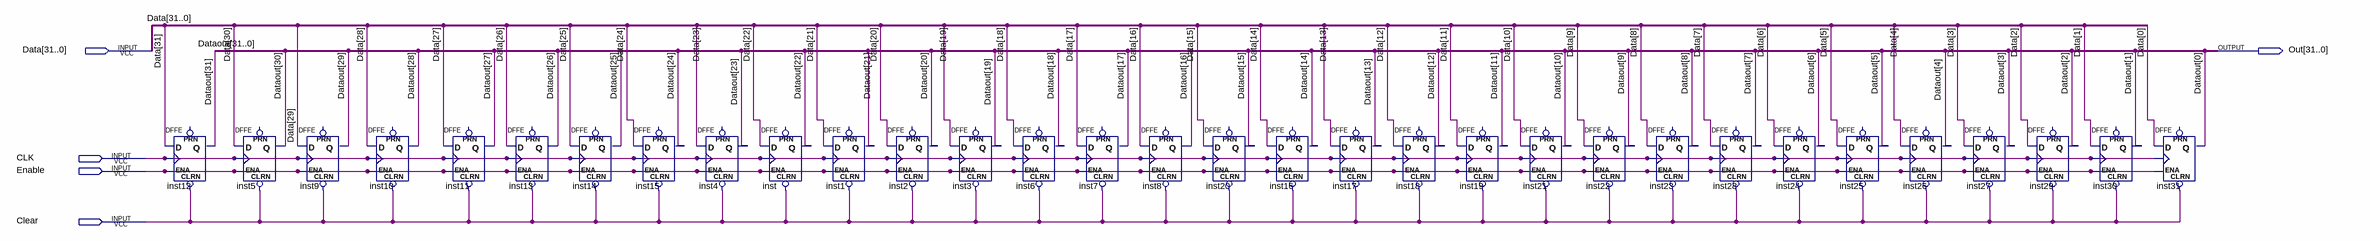
[diagram p0: schematic sheet]
// Quartus schematic Registrador32Bits.bdf as structural Verilog: 32 symbols, 5 pins
module Registrador32Bits (
  input  [31:0] Data,
  input  CLK,
  input  Enable,
  input  Clear,
  output [31:0] Out
);

  DFFE inst12 (.CLRN(Clear), .D(Data[31]), .CLK(CLK), .ENA(Enable), .Q(Out[31]));  // open: PRN
  DFFE inst5 (.CLRN(Clear), .D(Data[30]), .CLK(CLK), .ENA(Enable), .Q(Out[30]));  // open: PRN
  DFFE inst9 (.CLRN(Clear), .D(Data[29]), .CLK(CLK), .ENA(Enable), .Q(Out[29]));  // open: PRN
  DFFE inst10 (.CLRN(Clear), .D(Data[28]), .CLK(CLK), .ENA(Enable), .Q(Out[28]));  // open: PRN
  DFFE inst11 (.CLRN(Clear), .D(Data[27]), .CLK(CLK), .ENA(Enable), .Q(Out[27]));  // open: PRN
  DFFE inst13 (.CLRN(Clear), .D(Data[26]), .CLK(CLK), .ENA(Enable), .Q(Out[26]));  // open: PRN
  DFFE inst14 (.CLRN(Clear), .D(Data[25]), .CLK(CLK), .ENA(Enable), .Q(Out[25]));  // open: PRN
  DFFE inst15 (.CLRN(Clear), .D(Data[24]), .CLK(CLK), .ENA(Enable), .Q(Out[24]));  // open: PRN
  DFFE inst4 (.CLRN(Clear), .D(Data[23]), .CLK(CLK), .ENA(Enable), .Q(Out[23]));  // open: PRN
  DFFE inst (.CLRN(Clear), .D(Data[22]), .CLK(CLK), .ENA(Enable), .Q(Out[22]));  // open: PRN
  DFFE inst1 (.CLRN(Clear), .D(Data[21]), .CLK(CLK), .ENA(Enable), .Q(Out[21]));  // open: PRN
  DFFE inst2 (.CLRN(Clear), .D(Data[20]), .CLK(CLK), .ENA(Enable), .Q(Out[20]));  // open: PRN
  DFFE inst3 (.CLRN(Clear), .D(Data[19]), .CLK(CLK), .ENA(Enable), .Q(Out[19]));  // open: PRN
  DFFE inst6 (.CLRN(Clear), .D(Data[18]), .CLK(CLK), .ENA(Enable), .Q(Out[18]));  // open: PRN
  DFFE inst7 (.CLRN(Clear), .D(Data[17]), .CLK(CLK), .ENA(Enable), .Q(Out[17]));  // open: PRN
  DFFE inst8 (.CLRN(Clear), .D(Data[16]), .CLK(CLK), .ENA(Enable), .Q(Out[16]));  // open: PRN
  DFFE inst20 (.CLRN(Clear), .D(Data[15]), .CLK(CLK), .ENA(Enable), .Q(Out[15]));  // open: PRN
  DFFE inst16 (.CLRN(Clear), .D(Data[14]), .CLK(CLK), .ENA(Enable), .Q(Out[14]));  // open: PRN
  DFFE inst17 (.CLRN(Clear), .D(Data[13]), .CLK(CLK), .ENA(Enable), .Q(Out[13]));  // open: PRN
  DFFE inst18 (.CLRN(Clear), .D(Data[12]), .CLK(CLK), .ENA(Enable), .Q(Out[12]));  // open: PRN
  DFFE inst19 (.CLRN(Clear), .D(Data[11]), .CLK(CLK), .ENA(Enable), .Q(Out[11]));  // open: PRN
  DFFE inst21 (.CLRN(Clear), .D(Data[10]), .CLK(CLK), .ENA(Enable), .Q(Out[10]));  // open: PRN
  DFFE inst22 (.CLRN(Clear), .D(Data[9]), .CLK(CLK), .ENA(Enable), .Q(Out[9]));  // open: PRN
  DFFE inst23 (.CLRN(Clear), .D(Data[8]), .CLK(CLK), .ENA(Enable), .Q(Out[8]));  // open: PRN
  DFFE inst28 (.CLRN(Clear), .D(Data[7]), .CLK(CLK), .ENA(Enable), .Q(Out[7]));  // open: PRN
  DFFE inst24 (.CLRN(Clear), .D(Data[6]), .CLK(CLK), .ENA(Enable), .Q(Out[6]));  // open: PRN
  DFFE inst25 (.CLRN(Clear), .D(Data[5]), .CLK(CLK), .ENA(Enable), .Q(Out[5]));  // open: PRN
  DFFE inst26 (.CLRN(Clear), .D(Data[4]), .CLK(CLK), .ENA(Enable), .Q(Out[4]));  // open: PRN
  DFFE inst27 (.CLRN(Clear), .D(Data[3]), .CLK(CLK), .ENA(Enable), .Q(Out[3]));  // open: PRN
  DFFE inst29 (.CLRN(Clear), .D(Data[2]), .CLK(CLK), .ENA(Enable), .Q(Out[2]));  // open: PRN
  DFFE inst30 (.CLRN(Clear), .D(Data[1]), .CLK(CLK), .ENA(Enable), .Q(Out[1]));  // open: PRN
  DFFE inst31 (.CLRN(Clear), .D(Data[0]), .CLK(CLK), .ENA(Enable), .Q(Out[0]));  // open: PRN

  // Other names for the same wires on the sheet: Dataout[31:0] = Out
endmodule
